# Altium schematic sheet TOP.SchDoc: =DocumentName
size A4; Organization: Queen's Formula SAE; Address1: 130 Stuart St, Kingston; Address2: Ontario; Address3: Canada; Address4: K7L 2V9; DocumentNumber: 1; Revision: 0; SheetNumber: 1; SheetTotal: 1
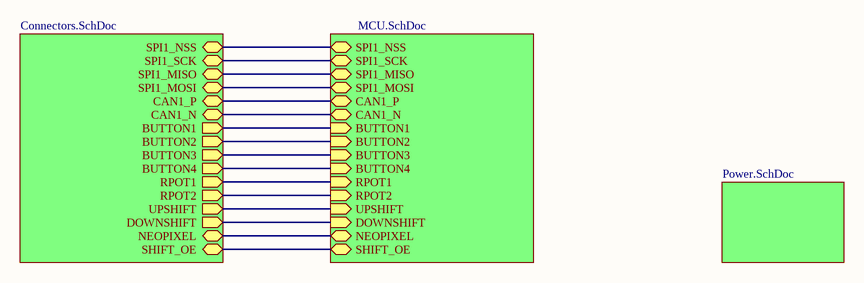
[diagram p0: TOP.SchDoc]

## Sub-sheets
Connectors = Connectors.SchDoc: SPI1_NSS (bidir), SPI1_SCK (bidir), SPI1_MISO (bidir), SPI1_MOSI (bidir), CAN1_P (bidir), CAN1_N (bidir), BUTTON1 (out), BUTTON2 (out), BUTTON3 (out), BUTTON4 (out), RPOT1 (out), RPOT2 (out), UPSHIFT (out), DOWNSHIFT (out), NEOPIXEL (bidir), SHIFT_OE (bidir)
MCU = MCU.SchDoc: SPI1_NSS (bidir), SPI1_SCK (bidir), SPI1_MISO (bidir), SPI1_MOSI (bidir), CAN1_P (bidir), CAN1_N (bidir), BUTTON1 (in), BUTTON2 (in), BUTTON3 (in), BUTTON4 (in), RPOT1 (in), RPOT2 (in), UPSHIFT (in), DOWNSHIFT (in), NEOPIXEL (bidir), SHIFT_OE (bidir)
Power = Power.SchDoc: no entries

## Nets
(unnamed): sheet MCU/SPI1_NSS, sheet Connectors/SPI1_NSS
(unnamed): sheet MCU/SPI1_SCK, sheet Connectors/SPI1_SCK
(unnamed): sheet MCU/SPI1_MISO, sheet Connectors/SPI1_MISO
(unnamed): sheet MCU/SPI1_MOSI, sheet Connectors/SPI1_MOSI
(unnamed): sheet MCU/CAN1_P, sheet Connectors/CAN1_P
(unnamed): sheet MCU/CAN1_N, sheet Connectors/CAN1_N
(unnamed): sheet MCU/BUTTON1, sheet Connectors/BUTTON1
(unnamed): sheet MCU/BUTTON2, sheet Connectors/BUTTON2
(unnamed): sheet MCU/BUTTON3, sheet Connectors/BUTTON3
(unnamed): sheet MCU/BUTTON4, sheet Connectors/BUTTON4
(unnamed): sheet MCU/RPOT1, sheet Connectors/RPOT1
(unnamed): sheet MCU/RPOT2, sheet Connectors/RPOT2
(unnamed): sheet MCU/UPSHIFT, sheet Connectors/UPSHIFT
(unnamed): sheet MCU/DOWNSHIFT, sheet Connectors/DOWNSHIFT
(unnamed): sheet MCU/NEOPIXEL, sheet Connectors/NEOPIXEL
(unnamed): sheet MCU/SHIFT_OE, sheet Connectors/SHIFT_OE

## Notes on the sheet
- Title
- Size:
- Date:
- A4
- Number:
- Time:
- Revision:
- Sheet
- of
- File: